# EAGLE design LocalR1.0 (EAGLE 9.6.2)
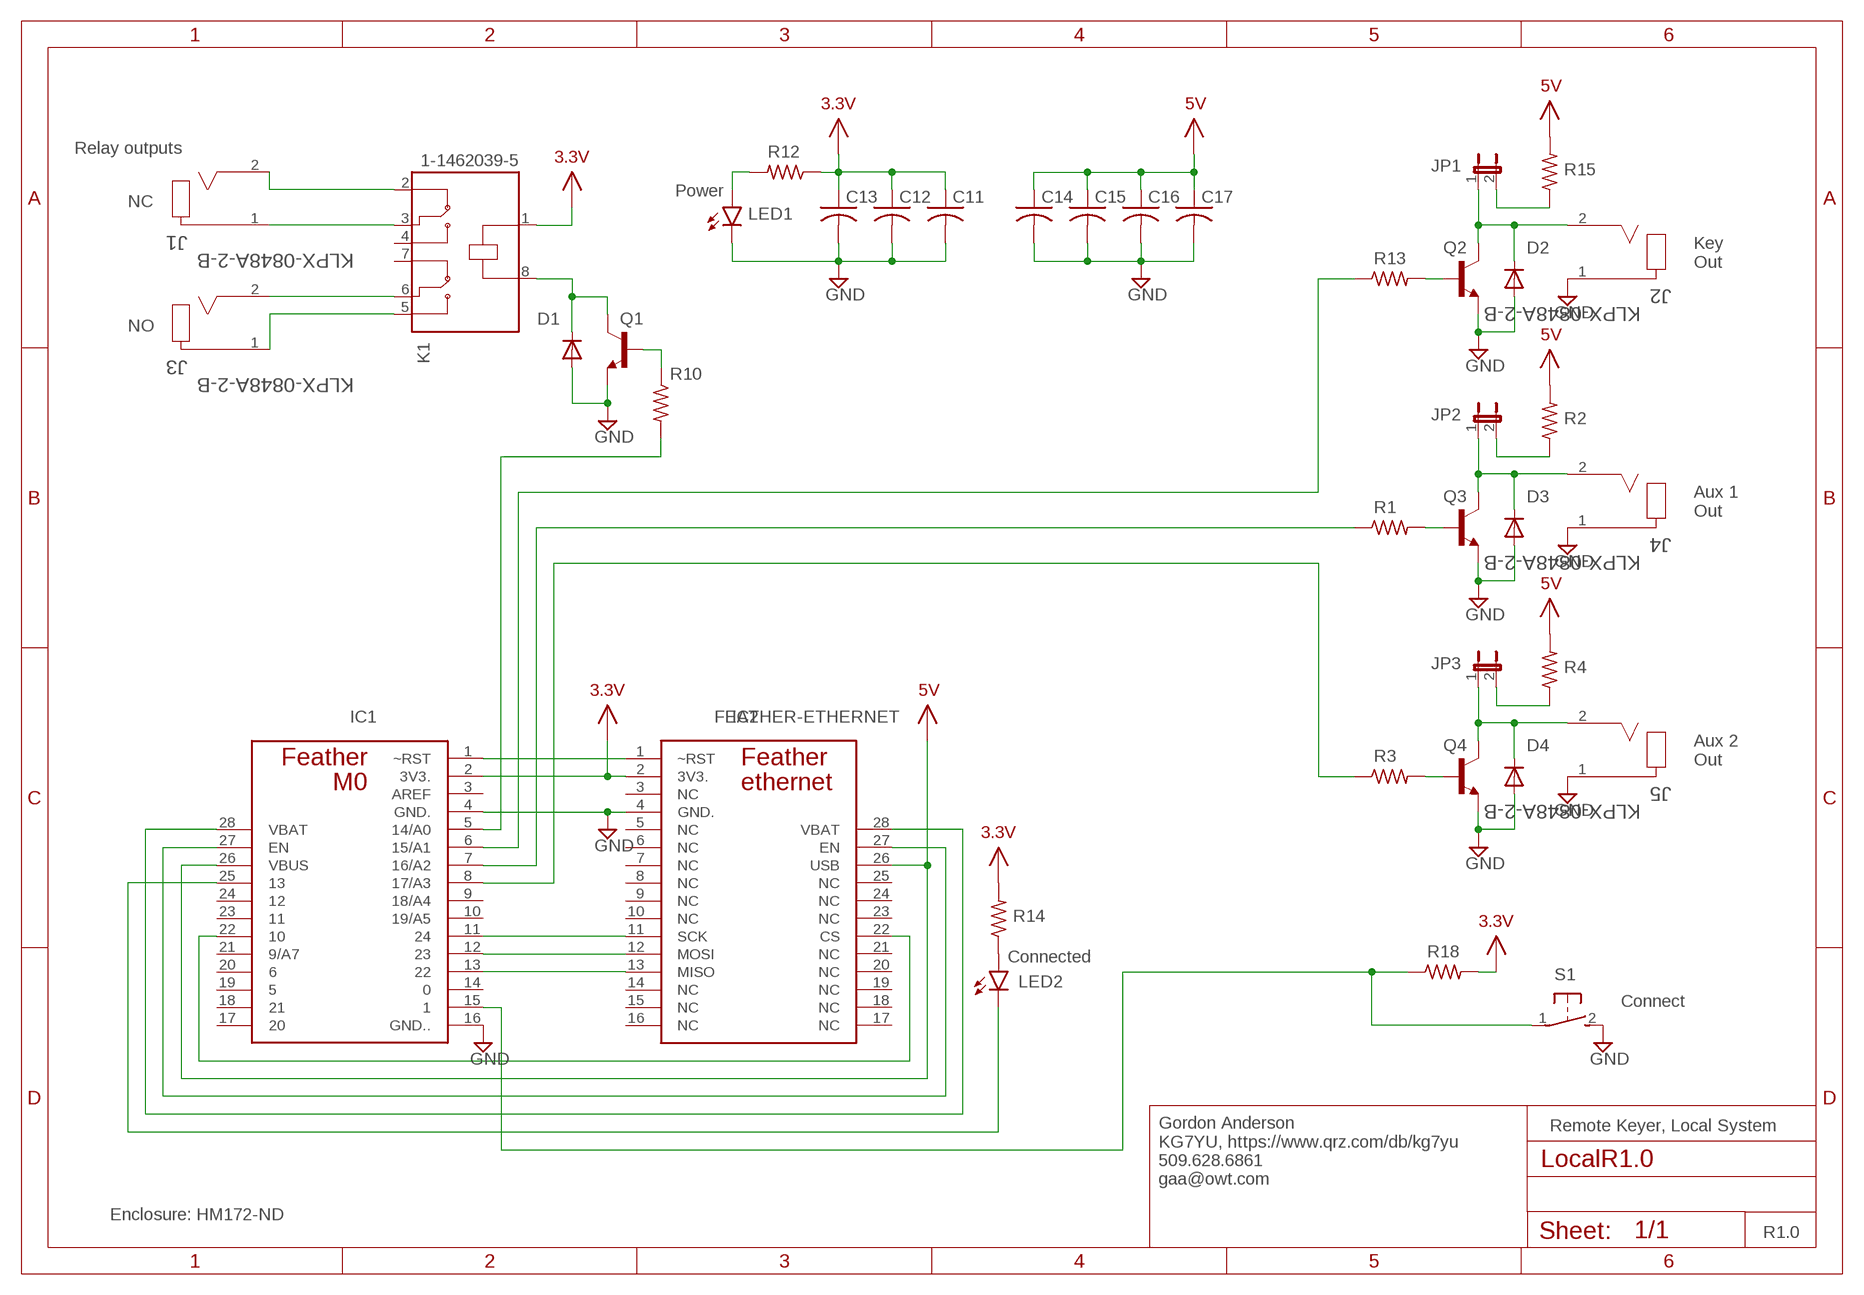
[diagram p0: schematic, sheet 1]

## Parts
C11  C-USC0805  [C0805]
C12  C-USC0805  [C0805]
C13  C-USC0805  [C0805]
C14  C-USC0805  [C0805]
C15  C-USC0805  [C0805]
C16  C-USC0805  [C0805]
C17  C-USC0805  [C0805]
D1  DIODE-SOD323-R  [SOD323-R]
D2  DIODE-SOD323-R  [SOD323-R]
D3  DIODE-SOD323-R  [SOD323-R]
D4  DIODE-SOD323-R  [SOD323-R]
IC1  FEATHER-M0  [FEATHER-M0]
IC2  FEATHER-ETHERNET  [FEATHER-ETHERNET]
J1  KLPX-0848A-2-B  [KLPX-0848A-2-B_KYC]
J2  KLPX-0848A-2-B  [KLPX-0848A-2-B_KYC]
J3  KLPX-0848A-2-B  [KLPX-0848A-2-B_KYC]
J4  KLPX-0848A-2-B  [KLPX-0848A-2-B_KYC]
J5  KLPX-0848A-2-B  [KLPX-0848A-2-B_KYC]
JP1  JP1E  [JP1]
JP2  JP1E  [JP1]
JP3  JP1E  [JP1]
K1  1-1462039-5  [RELAY_1-1462039-5]
LED1  LED5MM  [LED5MM]
LED2  LED5MM  [LED5MM]
Q1  MMBT2369LT1-NPN-SOT23-BEC  [SOT23-BEC]
Q2  MMBT2369LT1-NPN-SOT23-BEC  [SOT23-BEC]
Q3  MMBT2369LT1-NPN-SOT23-BEC  [SOT23-BEC]
Q4  MMBT2369LT1-NPN-SOT23-BEC  [SOT23-BEC]
R1  R-US_R0805  [R0805]
R2  R-US_R0805  [R0805]
R3  R-US_R0805  [R0805]
R4  R-US_R0805  [R0805]
R10  R-US_R0805  [R0805]
R12  R-US_R0805  [R0805]
R13  R-US_R0805  [R0805]
R14  R-US_R0805  [R0805]
R15  R-US_R0805  [R0805]
R18  R-US_R0805  [R0805]
S1  31-XX  [B3F-31XX]

## Nets
3.3V: C11.1 C12.1 C13.1 IC1.2(3V3.) IC2.2(3V3.) K1.1 R12.1 R14.2 R18.2
5V: C14.1 C15.1 C16.1 C17.1 IC1.26(VBUS) IC2.26(USB) R2.2 R4.2 R15.2
GND: C11.2 C12.2 C13.2 C14.2 C15.2 C16.2 C17.2 D1.A D2.A D3.A D4.A IC1.4(GND.) IC1.16(GND..) IC2.4(GND.) J2.1 J4.1 J5.1 LED1.K(C) Q1.E Q2.E Q3.E Q4.E S1.2(S)
N$1: Q2.B R13.2
N$2: J1.1 K1.3
N$3: J1.2 K1.2
N$4: J3.2 K1.6
N$5: J3.1 K1.5
N$6: Q3.B R1.2
N$7: JP2.2 R2.1
N$8: Q4.B R3.2
N$9: JP3.2 R4.1
N$10: IC1.13 IC2.13(MISO)
N$11: IC1.12 IC2.12(MOSI)
N$12: IC1.11 IC2.11(SCK)
N$13: IC1.1(~RST) IC2.1(~RST)
N$14: Q1.B R10.1
N$15: IC1.15 R18.1 S1.1(P)
N$17: IC1.22 IC2.22(CS)
N$18: IC1.6(15/A1) R13.1
N$19: IC1.27(EN) IC2.27(EN)
N$20: IC1.28(VBAT) IC2.28(VBAT)
N$21: IC1.7(16/A2) R1.1
N$22: IC1.8(17/A3) R3.1
N$23: LED1.A R12.2
N$24: LED2.A R14.1
N$25: IC1.25 LED2.K(C)
N$28: IC1.5(14/A0) R10.2
N$29: JP1.2 R15.1
RELAY-: D2.C J2.2 JP1.1 Q2.C
RELAY-1: D1.C K1.8 Q1.C
RELAY-2: D3.C J4.2 JP2.1 Q3.C
RELAY-3: D4.C J5.2 JP3.1 Q4.C
Unconnected: IC1.3(AREF) IC1.9(18/A4) IC1.10(19/A5) IC1.14 IC1.17 IC1.18 IC1.19 IC1.20 IC1.21(9/A7) IC1.23 IC1.24 IC2.3(NC) IC2.5(NC) IC2.6(NC) IC2.7(NC) IC2.8(NC) IC2.9(NC) IC2.10(NC) IC2.14(NC) IC2.15(NC) IC2.17(NC) IC2.18(NC) IC2.19(NC) IC2.20(NC) IC2.21(NC) IC2.23(NC) IC2.24(NC) IC2.25(NC) K1.4 K1.7

## Notes on the sheet
- Relay outputs
- Power
- NC
- Key
  Out
- NO
- Aux 1
  Out
- Aux 2
  Out
- Connected
- Connect
- Remote Keyer, Local System
- Gordon Anderson
  KG7YU, https://www.qrz.com/db/kg7yu
  509.628.6861
  gaa@owt.com
- Enclosure: HM172-ND
- R1.0

## Power pins joined to a net without a drawn wire
NC: IC2.16(NC)

## Library data of the parts
C11-C17 = rcl:C-US: CAPACITOR, American symbol; SPICEPREFIX: C
D1-D4 = diode:DIODE-: DIODE
IC1 = GAAextensions:FEATHER-M0
IC2 = GAAextensions:FEATHER-ETHERNET
J1-J5 = GAAextensions:KLPX-0848A-2-B; COPYRIGHT: Copyright (C) 2021 Ultra Librarian. All rights reserved.; DIGI-KEY_PART_NUMBER_1: 2092-KLPX-0848A-2-B-ND; MANUFACTURER_PART_NUMBER: KLPX-0848A-2-B; MFR_NAME: KYCON, INC.
JP1-JP3 = jumper:JP1E: JUMPER
K1 = 1-1462039-5:1-1462039-5: Signal Relay 3VDC 2A DPDT( (10mm 6mm 5.65mm)) THT Automotive; COMMENT: 1-1462039-5; DESCRIPTION: Signal Relay 3VDC 2A DPDT( (10mm 6mm 5.65mm)) THT Automotive; DIGI-KEY_PART_NUMBER: PB1167-ND; EU_ROHS_COMPLIANCE: Compliant; MF: TE Connectivity; MP: 1-1462039-5; PACKAGE: None; PURCHASE-URL: https://pricing.snapeda.com/search/part/1-1462039-5/?ref=eda
LED1 LED2 = led:LED: LED OSRAM: - CHIPLED LG R971, LG N971, LY N971, LG Q971, LY Q971, LO R971, LY R971 LH N974, LH R974 LS Q976, LO Q976, LY Q976 LO Q996 - Hyper CHIPLED LW Q18S LB Q993, LB Q99A, LB R99A - SideLED LS A670, LO A670, LY A670, LG A670, LP A670 LB A673, LV A673, LT A673, LW A673 LH A674 LY A675 LS A676, LA A676, LO A676, LY A676, LW A676 LS A679, LY A679, LG A679 - Hyper Micro SIDELED® LS Y876, LA Y876, LO Y876, LY Y876 LT Y87S - SmartLED LW L88C, LW L88S LB L89C, LB L89S, LG L890 LS L89K, LO L89K, LY L89K LS L896, LA L896, LO L896, LY L896 - TOPLED LS T670, LO T670, LY T670, LG T670, LP T670 LSG T670, LSP T670, LSY T670, LOP T670, LYG T670 LG T671, LOG T671, LSG T671 LB T673, LV T673, LT T673, LW T673 LH T674 LS T676, LA T676, LO T676, LY T676, LB T676, LH T676, LSB T676, LW T676 LB T67C, LV T67C, LT T67C, LS T67K, LO T67K, LY T67K, LW E67C LS E67B, LA E67B, LO E67B, LY E67B, LB E67C, LV E67C, LT E67C LW T67C LS T679, LY T679, LG T679 LS T770, LO T770, LY T770, LG T770, LP T770 LB T773, LV T773, LT T773, LW T773 LH T774 LS E675, LA E675, LY E675, LS T675 LS T776, LA T776, LO T776, LY T776, LB T776 LHGB T686 LT T68C, LB T68C - Hyper Mini TOPLED® LB M676 - Mini TOPLED Santana® LG M470 LS M47K, LO M47K, LY M47K Source: http://www.osram.convergy.de LUXEON: - LUMILED® LXK2-PW12-R00, LXK2-PW12-S00, LXK2-PW14-U00, LXK2-PW14-V00 LXK2-PM12-R00, LXK2-PM12-S00, LXK2-PM14-U00 LXK2-PE12-Q00, LXK2-PE12-R00, LXK2-PE12-S00, LXK2-PE14-T00, LXK2-PE14-U00 LXK2-PB12-K00, LXK2-PB12-L00, LXK2-PB12-M00, LXK2-PB14-N00, LXK2-PB14-P00, LXK2-PB14-Q00 LXK2-PR12-L00, LXK2-PR12-M00, LXK2-PR14-Q00, LXK2-PR14-R00 LXK2-PD12-Q00, LXK2-PD12-R00, LXK2-PD12-S00 LXK2-PH12-R00, LXK2-PH12-S00 LXK2-PL12-P00, LXK2-PL12-Q00, LXK2-PL12-R00 Source: www.luxeon.com KINGBRIGHT: KA-3528ASYC Source: www.kingbright.com
Q1-Q4 = GAAextensions:*-NPN-: NPN Transistror
R1-R4 R10 R12-R15 R18 = rcl:R-US_: RESISTOR, American symbol; SPICEPREFIX: R
S1 = switch-omron:31-XX: OMRON SWITCH; MPN: B3F-3100; OC_FARNELL: 959704; OC_NEWARK: 36M3582

## Board
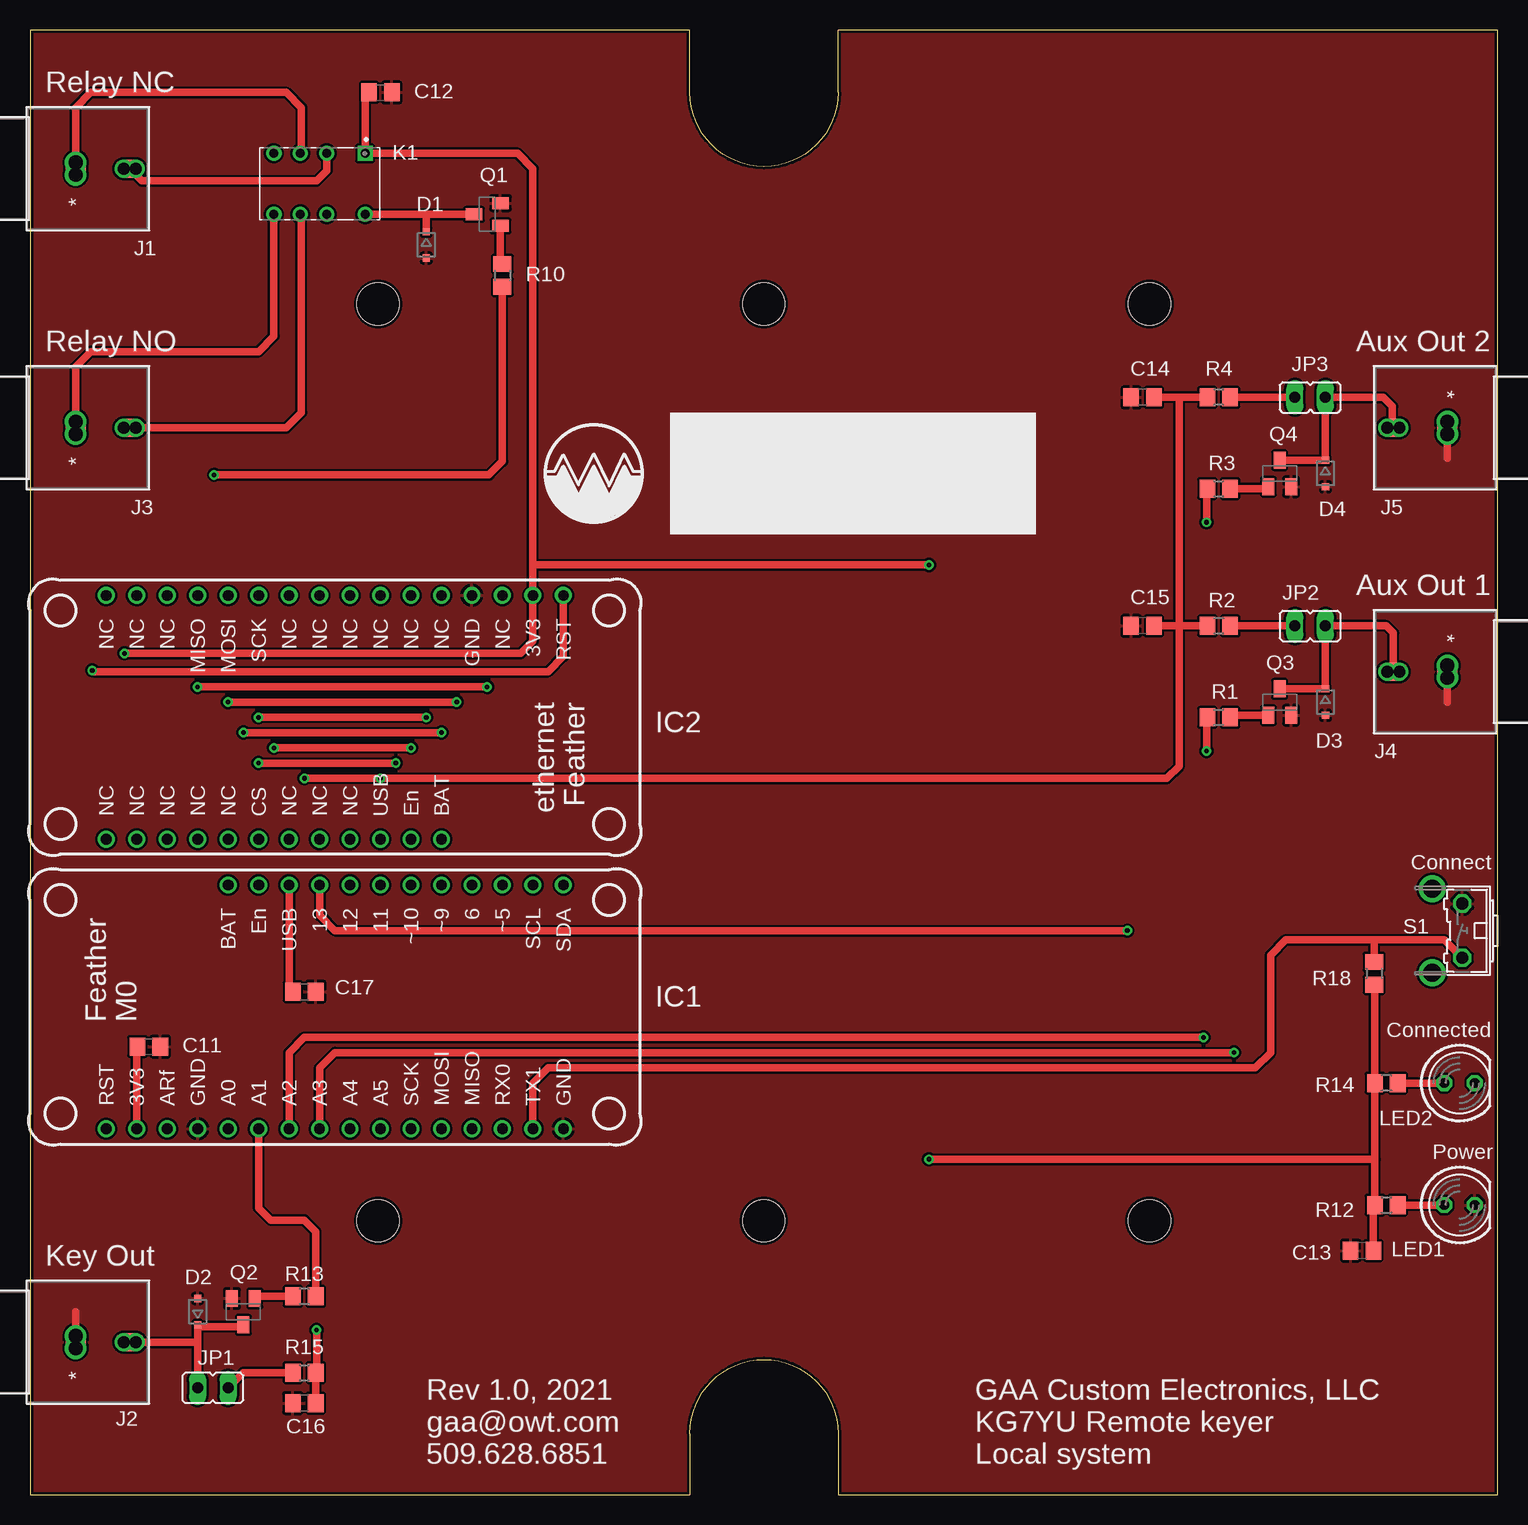
[diagram p1: board, top side]
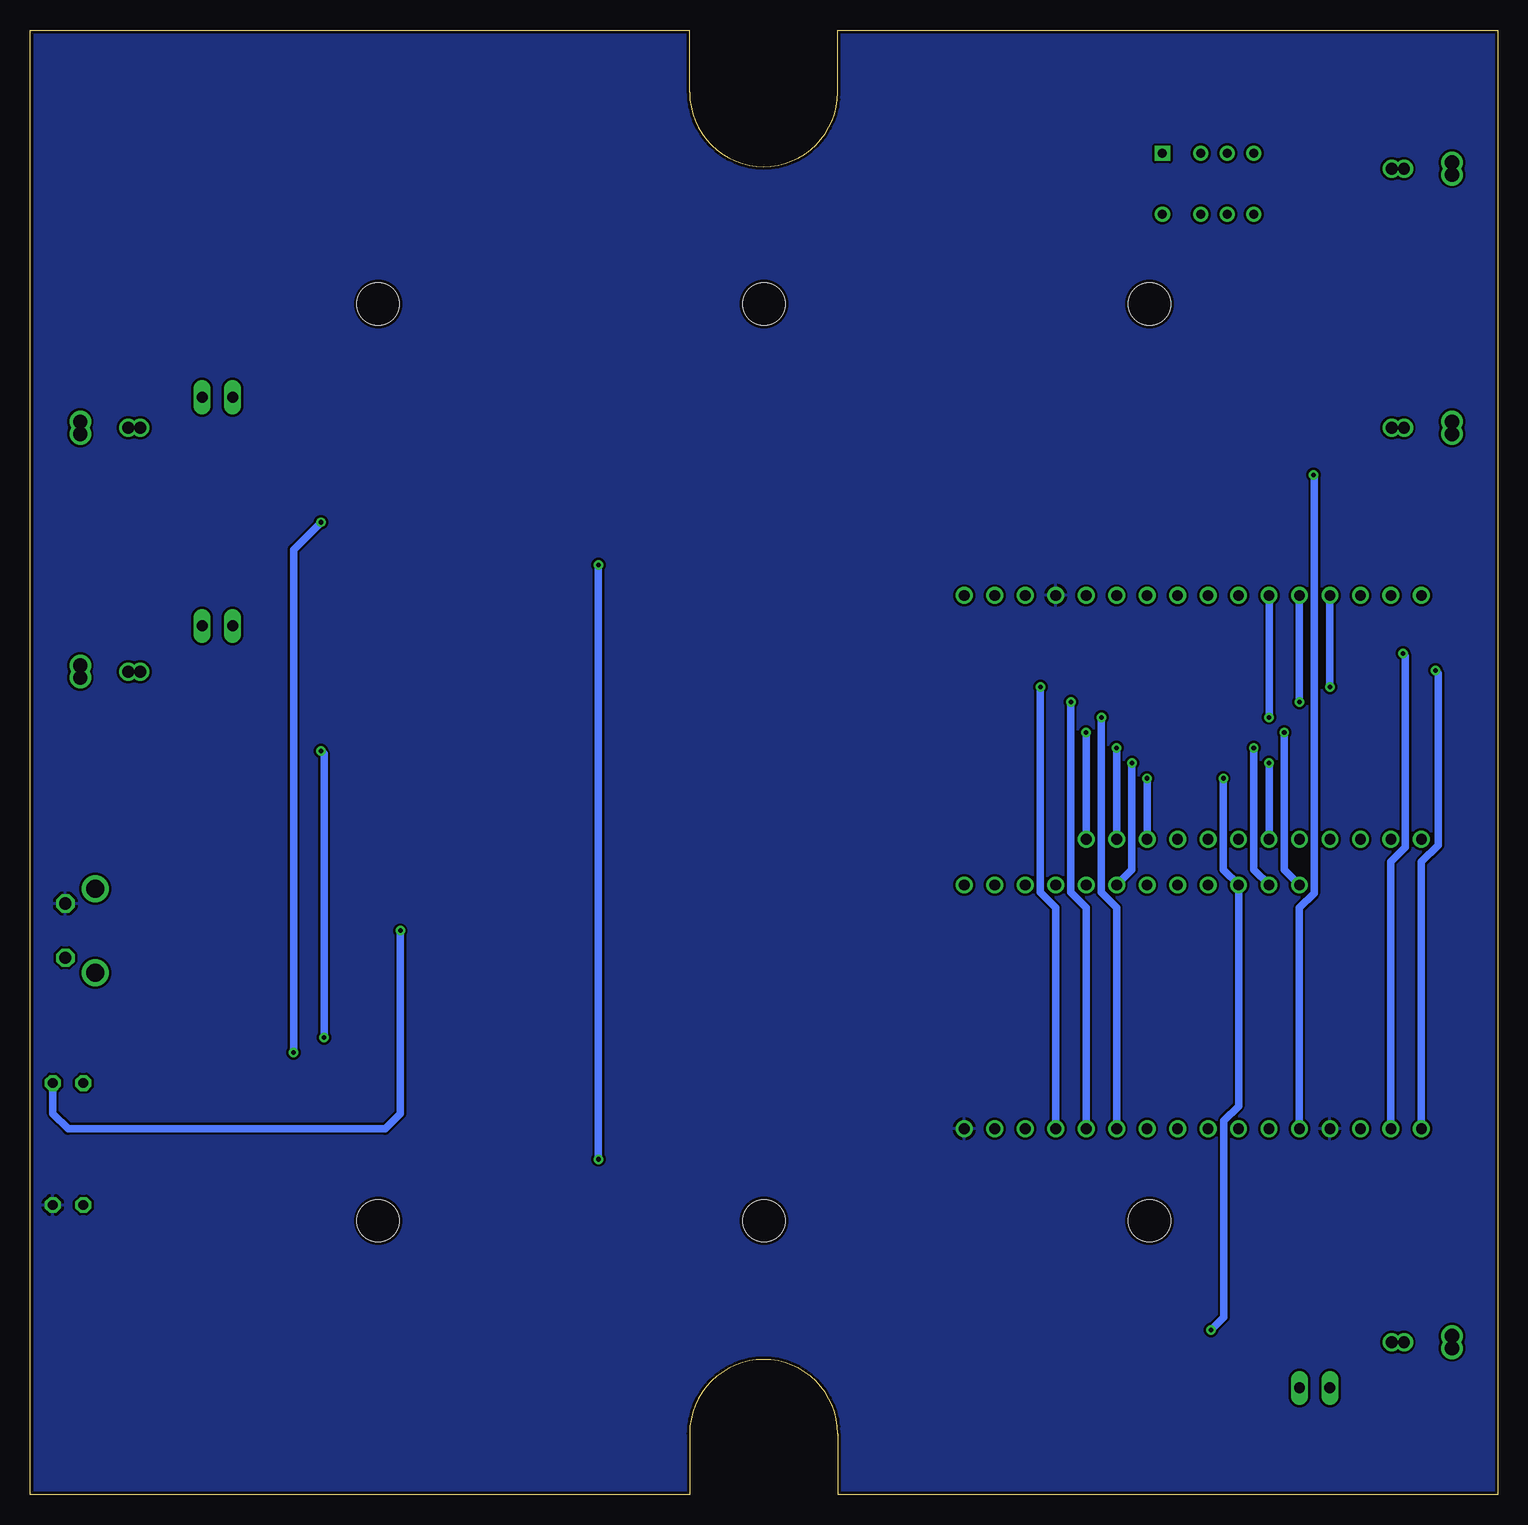
[diagram p2: board, bottom side, seen from below]

Size 122.3 x 122.05 mm. Coordinates in mm from the lower left corner, seen from the top.
Outline: 0,0 54.99,0 54.99,5.08 arc-180 67.33,5.08 67.33,0 122.3,0 122.3,122.05 67.33,122.05 67.33,116.84 arc-180 54.99,116.84 54.99,122.05 0,122.05 0,0
Copper layers (1*16): Top 0.035mm / dielectric 1.5mm / Bottom 0.035mm
Design rules "default *": minimum track width 6mil, minimum drill 0.35mm, track to track 8mil, track to pad 8mil, pad to pad 8mil, via to via 8mil, smd to smd 8mil, copper to edge 10mil, drill to drill 6mil, minimum pad ring 10mil, minimum via ring 8mil, stop-mask expansion 4mil, vias tented up to drill 50mil, thermal gap 10mil
Holes 3.51 mm at 29.01,22.81 61.14,22.81 93.29,22.81 29.01,99.21 61.14,99.21 93.29,99.21

### Footprints (pad centres in the part's own frame; a part is rotated, then mirrored left to right if it is on the bottom)
C0805 = smd 1.3 x 1.5: 1 -0.95,0; 2 0.95,0
SOD323-R = smd 0.6 x 0.6: A 1.1,0; C -1.1,0
FEATHER-M0 = drill 0.9: 1 0,7.62; 2 0,5.08; 3 0,2.54; 4 0,0; 5 0,-2.54; 6 0,-5.08; 7 0,-7.62; 8 0,-10.16; 9 0,-12.7; 10 0,-15.24; 11 0,-17.78; 12 0,-20.32; 13 0,-22.86; 14 0,-25.4; 15 0,-27.94; 16 0,-30.48; 17 20.32,-30.48; 18 20.32,-27.94; 19 20.32,-25.4; 20 20.32,-22.86; 21 20.32,-20.32; 22 20.32,-17.78; 23 20.32,-15.24; 24 20.32,-12.7; 25 20.32,-10.16; 26 20.32,-7.62; 27 20.32,-5.08; 28 20.32,-2.54
FEATHER-ETHERNET = drill 0.9: 1 -10.16,17.78; 2 -10.16,15.24; 3 -10.16,12.7; 4 -10.16,10.16; 5 -10.16,7.62; 6 -10.16,5.08; 7 -10.16,2.54; 8 -10.16,0; 9 -10.16,-2.54; 10 -10.16,-5.08; 11 -10.16,-7.62; 12 -10.16,-10.16; 13 -10.16,-12.7; 14 -10.16,-15.24; 15 -10.16,-17.78; 16 -10.16,-20.32; 17 10.16,-20.32; 18 10.16,-17.78; 19 10.16,-15.24; 20 10.16,-12.7; 21 10.16,-10.16; 22 10.16,-7.62; 23 10.16,-5.08; 24 10.16,-2.54; 25 10.16,0; 26 10.16,2.54; 27 10.16,5.08; 28 10.16,7.62
KLPX-0848A-2-B_KYC = smd 2.718 x 1.702: 1 0,0 | smd 1.499 x 2.515: 2 0,-4.5 | drill 1.194 pad 1.194: S_1_H1 0.508,0; S_1_H2 -0.508,0 | drill 0.991 pad 0.991: S_2_H1 0,-3.988; S_2_H2 0,-5.004
JP1 = drill 0.914 long: 1 0,-1.27; 2 0,1.27
RELAY_1-1462039-5 = drill 0.75 square: 1 -2.54,3.8 | drill 0.75: 2 -2.54,0.6; 3 -2.54,-1.6; 4 -2.54,-3.8; 5 2.54,-3.8; 6 2.54,-1.6; 7 2.54,0.6; 8 2.54,3.8
LED5MM = drill 0.813 octagon: A -1.27,0; K 1.27,0
SOT23-BEC = smd 1 x 1.4: B -0.95,-1.1; C 0,1.1; E 0.95,-1.1
R0805 = smd 1.3 x 1.5: 1 -0.95,0; 2 0.95,0
B3F-31XX = drill 1.016 octagon: 1 -2.261,-1.245; 2 2.261,-1.245 | drill 1.499 pad 2.159: 3 -3.505,1.245; 4 3.505,1.245

### Placement (x,y rotation side)
C11  9.91,37.34 0 top
C12  29.21,116.84 0 top
C13  111,20.32 180 top
C14  92.71,91.44 180 top
C15  92.71,72.39 180 top
C16  22.86,7.62 180 top
C17  22.86,41.91 0 top
D1  33.02,104.14 270 top
D2  13.97,15.24 90 top
D3  107.95,66.04 270 top
D4  107.95,85.09 270 top
IC1  13.97,30.48 90 top
IC2  26.67,64.77 270 top
J1  3.81,110.49 90 top
J2  3.81,12.7 90 top
J3  3.81,88.9 90 top
J4  118.11,68.58 270 top
J5  118.11,88.9 270 top
JP1  15.24,8.89 270 top
JP2  106.68,72.39 90 top
JP3  106.68,91.44 90 top
K1  24.13,109.22 270 top
LED1  119.13,24.13 0 top
LED2  119.13,34.29 0 top
Q1  38.1,106.68 90 top
Q2  17.78,15.24 180 top
Q3  104.14,66.04 0 top
Q4  104.14,85.09 0 top
R1  99.06,64.77 0 top
R2  99.06,72.39 180 top
R3  99.06,83.82 0 top
R4  99.06,91.44 180 top
R10  39.37,101.6 270 top
R12  113.03,24.13 0 top
R13  22.86,16.51 180 top
R14  113.03,34.29 180 top
R15  22.86,10.16 0 top
R18  112.01,43.43 270 top
S1  118.11,46.99 90 top
U$1  [LOGO2]  46.99,85.09 0 top

### Tracks (layer width: path | path; a pad name or v marks a point on that pad's centre or on a via)
3.3V  (via drill 0.38)
  Top 0.61: IC1.2 8.89,37.27 C11.1 | C12.1 27.93,116.51 K1.1 40.64,111.76 41.91,110.49 41.91,77.47 | v7.87,70.1 40.89,70.1 41.91,71.12 IC2.2 41.91,77.47 | C13.1 111.95,24 R12.1 112.08,27.94 | 112.08,27.94 R14.2 112.08,42.42 R18.2 | 41.91,77.47 v74.93,77.47 | v74.93,27.94 112.08,27.94
  Bottom 0.61: IC1.2 8.89,52.71 7.68,53.93 7.68,69.91 v7.87,70.1 | v74.93,77.47 v74.93,27.94
5V  (via drill 0.38)
  Top 0.61: v22.86,59.69 v29.21,59.69 94.74,59.69 95.76,60.71 95.76,72.39 | IC1.26 21.59,42.23 C17.1 | C16.1 R15.2 23.88,10.23 v23.88,13.72 | R4.2 95.76,91.44 | 95.76,91.44 C14.1 | R2.2 95.76,72.39 | 95.76,72.39 C15.1 | 95.76,72.39 95.76,91.44
  Bottom 0.61: v22.86,59.69 22.86,52.07 IC1.26 21.59,32.38 22.8,31.16 22.8,14.79 v23.88,13.72 | IC2.26 v29.21,59.69
GND
  Top 0.61: J2.1 3.81,15.24 | J5.1 118.11,86.36 | J4.1 118.11,66.04
  pour Top: 0,121.92 121.92,121.92 121.92,0 0,0
  pour Bottom: 0,121.92 121.92,121.92 121.92,0 0,0
N$1
  Top 0.61: R13.2 18.9,16.51 Q2.B
N$2
  Top 0.61: J1.1 3.81,115.57 5.08,116.84 21.34,116.84 22.61,115.57 22.61,111.84 K1.3
N$3
  Top 0.61: K1.2 24.73,110.33 23.88,109.47 9.33,109.47 J1.2
N$4
  Top 0.61: J3.2 21.34,88.9 22.61,90.17 22.61,106.6 K1.6
N$5
  Top 0.61: J3.1 3.81,93.98 5.08,95.25 19.05,95.25 20.33,96.53 K1.5
N$6
  Top 0.61: R1.2 100.18,64.94 Q3.B
N$7
  Top 0.61: R2.1 JP2.2
N$8
  Top 0.61: Q4.B 103.02,83.82 R3.2
N$9
  Top 0.61: JP3.2 R4.1
N$10  (via drill 0.38)
  Top 0.61: v13.97,67.31 v38.1,67.31
  Bottom 0.61: IC1.13 36.83,48.9 38.1,50.17 v38.1,67.31 | IC2.13 v13.97,67.31
N$11  (via drill 0.38)
  Top 0.61: v16.51,66.04 v35.56,66.04
  Bottom 0.61: IC1.12 34.29,48.9 35.56,50.17 v35.56,66.04 | IC2.12 v16.51,66.04
N$12  (via drill 0.38)
  Top 0.61: v33.02,64.77 v19.05,64.77
  Bottom 0.61: IC1.11 31.75,48.9 33.02,50.17 v33.02,64.77 | IC2.11 v19.05,64.77
N$13  (via drill 0.38)
  Top 0.61: v5.19,68.69 5.3,68.58 43.18,68.58 44.45,69.85 IC2.1
  Bottom 0.61: IC1.1 6.35,52.71 4.93,54.13 4.93,68.44 v5.19,68.69
N$14
  Top 0.61: R10.1 39.2,102.72 Q1.B
N$15
  Top 0.61: IC1.15 41.91,34.29 43.18,35.56 102.11,35.56 103.38,36.83 103.38,44.96 104.65,46.23 112.01,46.23 | 112.01,46.23 117.86,46.23 S1.1 | R18.1 112.01,46.23
N$17  (via drill 0.38)
  Top 0.61: v19.05,60.96 v30.48,60.96
  Bottom 0.61: IC1.22 30.48,52.07 v30.48,60.96 | IC2.22 v19.05,60.96
N$18
  Top 0.61: R13.1 23.81,21.91 22.86,22.86 20.07,22.86 19.05,23.88 IC1.6
N$19  (via drill 0.38)
  Top 0.61: v31.75,62.23 v20.32,62.23
  Bottom 0.61: IC1.27 20.32,52.07 v20.32,62.23 | IC2.27 v31.75,62.23
N$20  (via drill 0.38)
  Top 0.61: v17.78,63.5 v34.29,63.5
  Bottom 0.61: IC1.28 17.78,52.07 v17.78,63.5 | IC2.28 v34.29,63.5
N$21  (via drill 0.38)
  Top 0.61: IC1.7 21.59,36.83 22.86,38.1 v97.79,38.1 | v98.04,61.98 98.04,64.7 R1.1
  Bottom 0.61: v97.79,38.1 97.79,61.72 v98.04,61.98
N$22  (via drill 0.38)
  Top 0.61: IC1.8 24.13,35.56 25.4,36.83 v100.33,36.83 | v98.04,81.03 98.04,83.75 R3.1
  Bottom 0.61: v100.33,36.83 100.33,78.74 v98.04,81.03
N$23
  Top 0.61: LED1.A R12.2
N$24
  Top 0.61: LED2.A R14.1
N$25  (via drill 0.38)
  Top 0.61: IC1.25 24.13,48.26 25.4,46.99 v91.44,46.99
  Bottom 0.61: v91.44,46.99 91.44,31.75 92.71,30.48 119.13,30.48 120.4,31.75 LED2.K
N$28  (via drill 0.38)
  Top 0.61: v15.35,84.98 38.24,84.98 39.37,86.11 R10.2
  Bottom 0.61: IC1.5 16.51,48.9 15.3,50.12 15.3,84.93 v15.35,84.98
N$29
  Top 0.61: R15.1 17.78,10.16 JP1.2
RELAY-
  Top 0.61: JP1.1 13.97,12.7 | 13.97,12.7 13.97,13.97 | 13.97,13.97 D2.C | Q2.C 17.61,13.97 13.97,13.97 | J2.2 13.97,12.7
RELAY-1
  Top 0.61: K1.8 33.02,106.68 | 33.02,106.68 Q1.C | D1.C 33.02,106.68
RELAY-2
  Top 0.61: J4.2 113.61,71.81 113.03,72.39 JP2.1 D3.C Q3.C
RELAY-3
  Top 0.61: J5.2 113.54,88.97 113.54,90.68 112.78,91.44 JP3.1 D4.C Q4.C

### Text on the board
tPlace: Relay NC | Relay NO | Aux Out 2 | Aux Out 1 | Connect | Connected | Power | Key Out | Rev 1.0, 2021 / gaa@owt.com / 509.628.6851 | GAA Custom Electronics, LLC / KG7YU Remote keyer / Local system